# Altium schematic sheet I2C Multiplexer.SchDoc: I2C 8 Channel Multiplexer
size A3; SheetNumber: 29; SheetTotal: 37
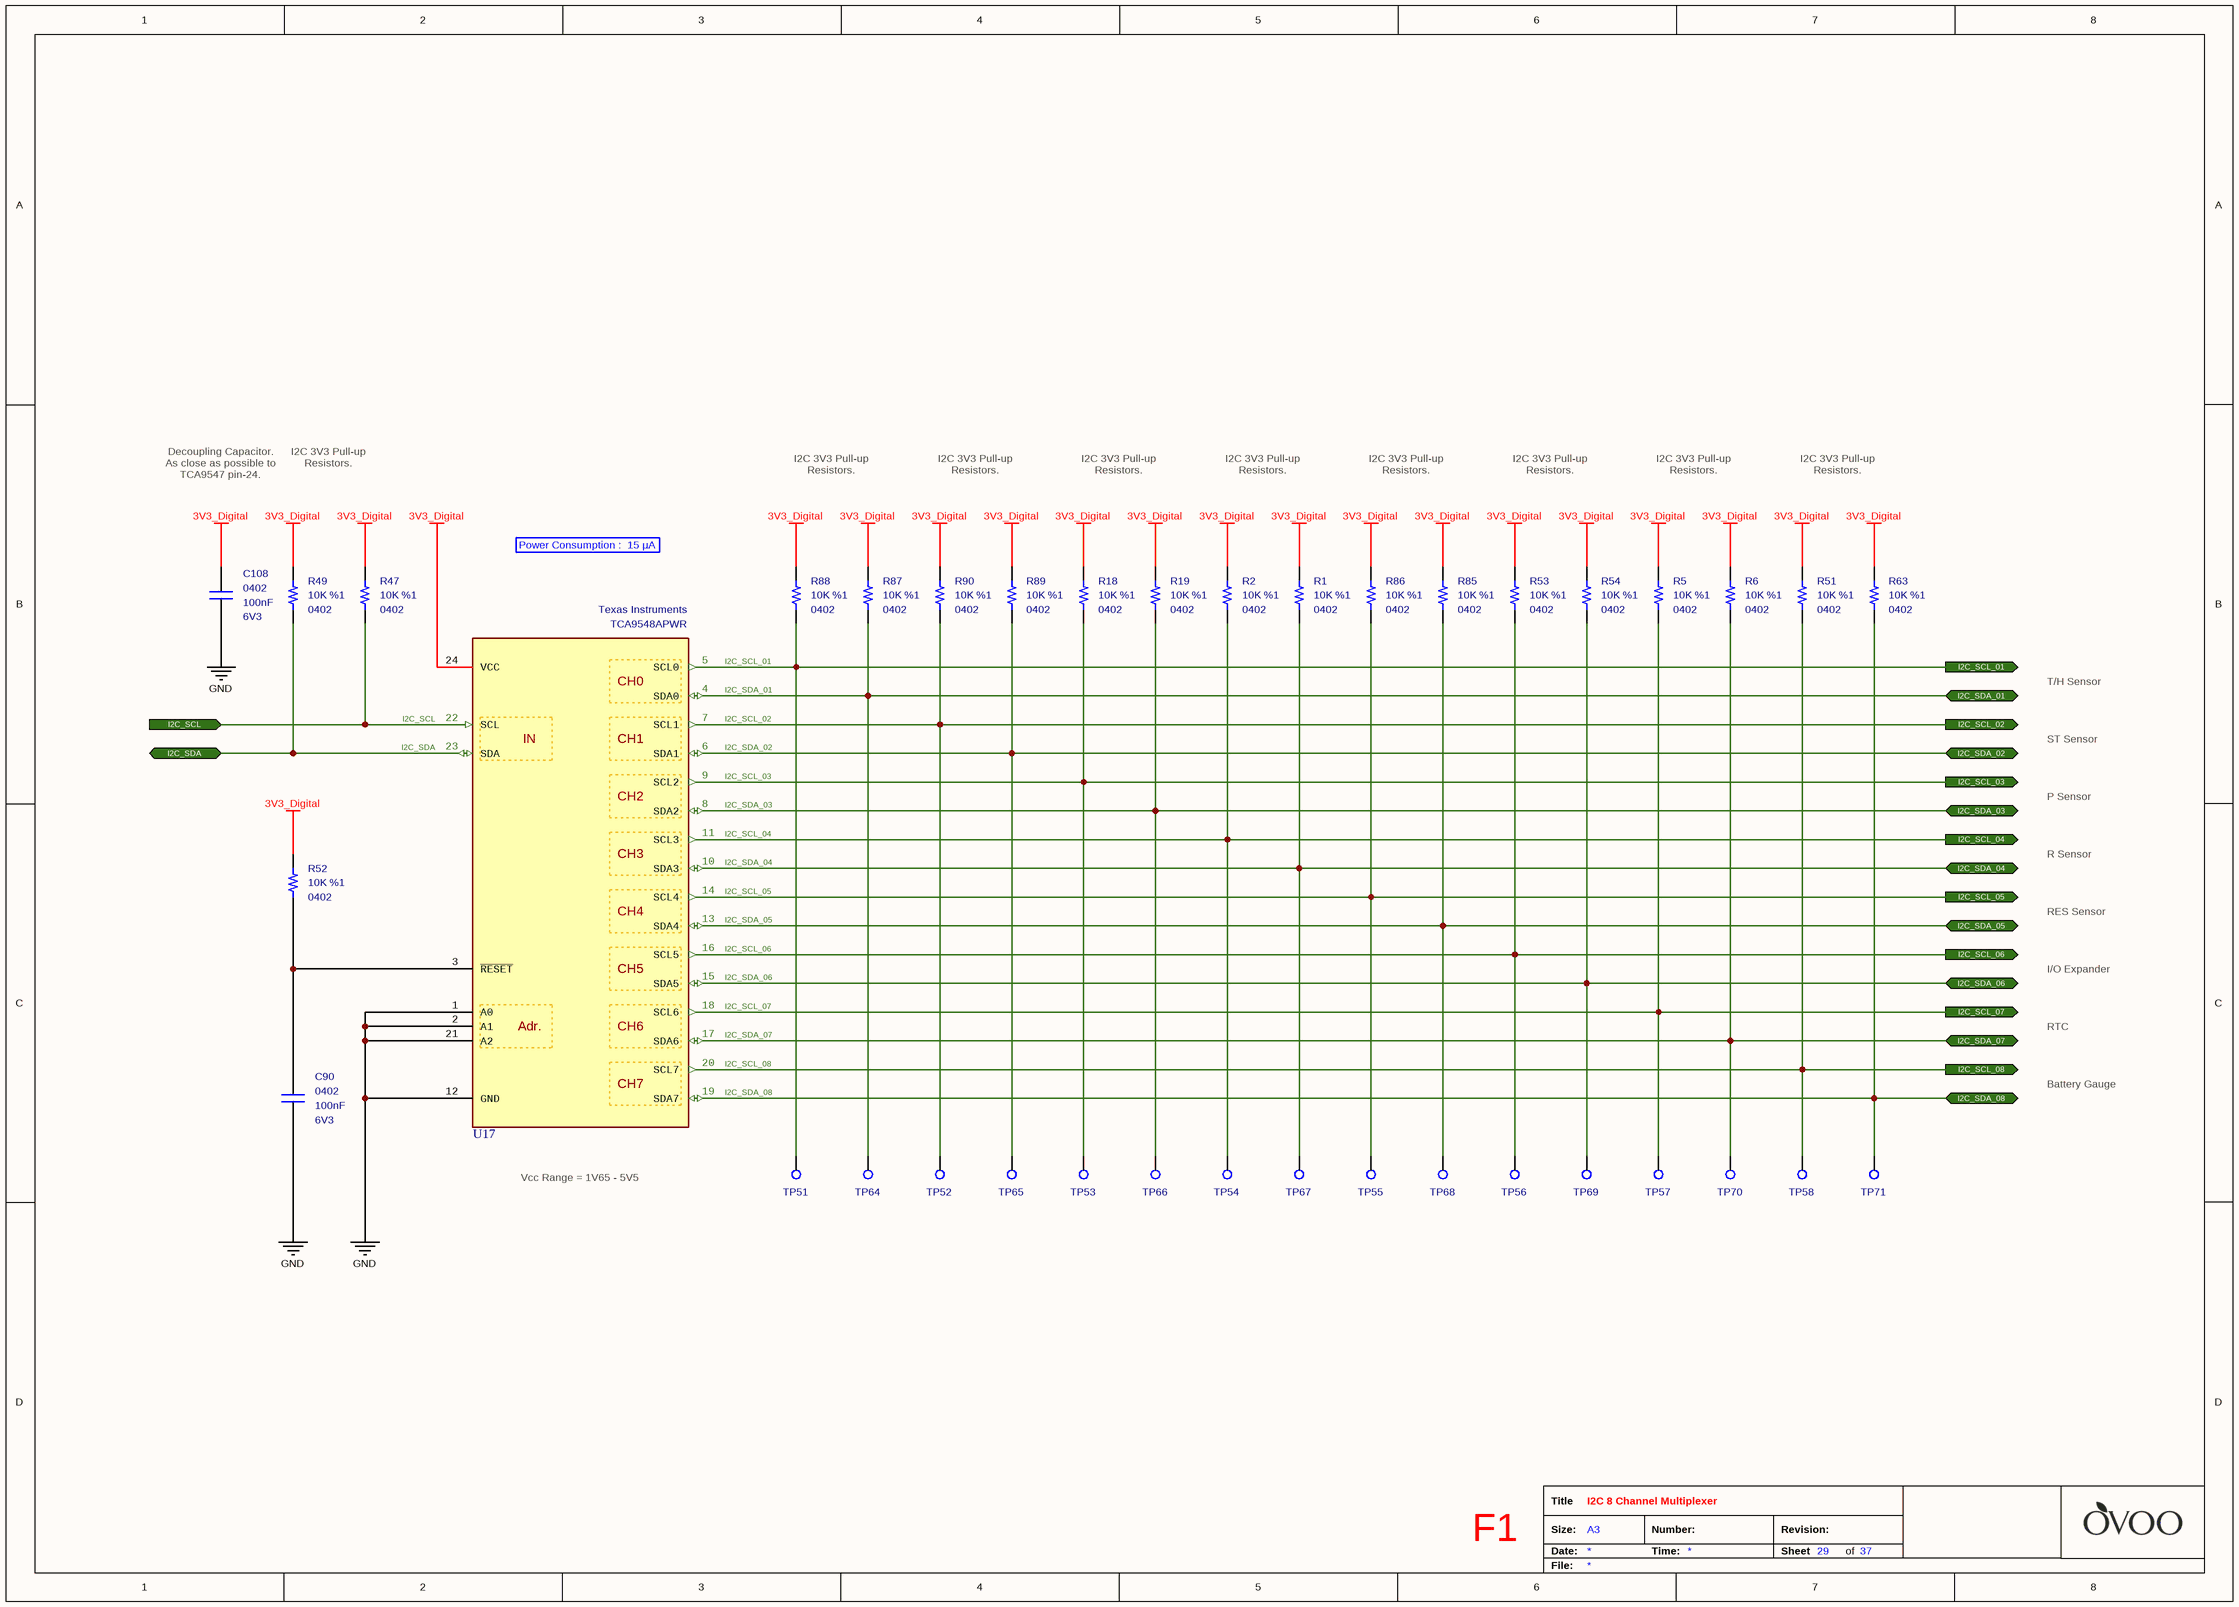
[diagram p0: I2C Multiplexer.SchDoc]

## Parts
C90  value 100nF  Case: 0402  Voltage: 6V3  [CAPACITOR_0402]  (hidden comment: Multilayer Ceramic Capacitor)
C108  value 100nF  Case: 0402  Voltage: 6V3  [CAPACITOR_0402]  (hidden comment: Multilayer Ceramic Capacitor)
R1  value 10K  Tolerance: %1  Case: 0402  [RESISTOR_0402]  (hidden comment: Thick Film Resistor)
R2  value 10K  Tolerance: %1  Case: 0402  [RESISTOR_0402]  (hidden comment: Thick Film Resistor)
R5  value 10K  Tolerance: %1  Case: 0402  [RESISTOR_0402]  (hidden comment: Thick Film Resistor)
R6  value 10K  Tolerance: %1  Case: 0402  [RESISTOR_0402]  (hidden comment: Thick Film Resistor)
R18  value 10K  Tolerance: %1  Case: 0402  [RESISTOR_0402]  (hidden comment: Thick Film Resistor)
R19  value 10K  Tolerance: %1  Case: 0402  [RESISTOR_0402]  (hidden comment: Thick Film Resistor)
R47  value 10K  Tolerance: %1  Case: 0402  [RESISTOR_0402]  (hidden comment: Thick Film Resistor)
R49  value 10K  Tolerance: %1  Case: 0402  [RESISTOR_0402]  (hidden comment: Thick Film Resistor)
R51  value 10K  Tolerance: %1  Case: 0402  [RESISTOR_0402]  (hidden comment: Thick Film Resistor)
R52  value 10K  Tolerance: %1  Case: 0402  [RESISTOR_0402]  (hidden comment: Thick Film Resistor)
R53  value 10K  Tolerance: %1  Case: 0402  [RESISTOR_0402]  (hidden comment: Thick Film Resistor)
R54  value 10K  Tolerance: %1  Case: 0402  [RESISTOR_0402]  (hidden comment: Thick Film Resistor)
R63  value 10K  Tolerance: %1  Case: 0402  [RESISTOR_0402]  (hidden comment: Thick Film Resistor)
R85  value 10K  Tolerance: %1  Case: 0402  [RESISTOR_0402]  (hidden comment: Thick Film Resistor)
R86  value 10K  Tolerance: %1  Case: 0402  [RESISTOR_0402]  (hidden comment: Thick Film Resistor)
R87  value 10K  Tolerance: %1  Case: 0402  [RESISTOR_0402]  (hidden comment: Thick Film Resistor)
R88  value 10K  Tolerance: %1  Case: 0402  [RESISTOR_0402]  (hidden comment: Thick Film Resistor)
R89  value 10K  Tolerance: %1  Case: 0402  [RESISTOR_0402]  (hidden comment: Thick Film Resistor)
R90  value 10K  Tolerance: %1  Case: 0402  [RESISTOR_0402]  (hidden comment: Thick Film Resistor)
TP51  PCB - Test Point  [Test_Pad - Hole]  (value not drawn)  (no BOM)
TP52  PCB - Test Point  [Test_Pad - Hole]  (value not drawn)  (no BOM)
TP53  PCB - Test Point  [Test_Pad - Hole]  (value not drawn)  (no BOM)
TP54  PCB - Test Point  [Test_Pad - Hole]  (value not drawn)  (no BOM)
TP55  PCB - Test Point  [Test_Pad - Hole]  (value not drawn)  (no BOM)
TP56  PCB - Test Point  [Test_Pad - Hole]  (value not drawn)  (no BOM)
TP57  PCB - Test Point  [Test_Pad - Hole]  (value not drawn)  (no BOM)
TP58  PCB - Test Point  [Test_Pad - Hole]  (value not drawn)  (no BOM)
TP64  PCB - Test Point  [Test_Pad - Hole]  (value not drawn)  (no BOM)
TP65  PCB - Test Point  [Test_Pad - Hole]  (value not drawn)  (no BOM)
TP66  PCB - Test Point  [Test_Pad - Hole]  (value not drawn)  (no BOM)
TP67  PCB - Test Point  [Test_Pad - Hole]  (value not drawn)  (no BOM)
TP68  PCB - Test Point  [Test_Pad - Hole]  (value not drawn)  (no BOM)
TP69  PCB - Test Point  [Test_Pad - Hole]  (value not drawn)  (no BOM)
TP70  PCB - Test Point  [Test_Pad - Hole]  (value not drawn)  (no BOM)
TP71  PCB - Test Point  [Test_Pad - Hole]  (value not drawn)  (no BOM)
U17  Manufacturer_Part_Number: TCA9548APWR  Manufacturer_Name: Texas Instruments  [TSSOP-24]  (hidden comment: I2C Switch IC)

## Ports
I2C_SCL (in), I2C_SCL_01 (out), I2C_SCL_02 (out), I2C_SCL_03 (out), I2C_SCL_04 (out), I2C_SCL_05 (out), I2C_SCL_06 (out), I2C_SCL_07 (out), I2C_SCL_08 (out), I2C_SDA (bidir), I2C_SDA_01 (bidir), I2C_SDA_02 (bidir), I2C_SDA_03 (bidir), I2C_SDA_04 (bidir), I2C_SDA_05 (bidir), I2C_SDA_06 (bidir), I2C_SDA_07 (bidir), I2C_SDA_08 (bidir)

## Nets
3V3_Digital: C108.2 R1.2 R2.2 R5.2 R6.2 R18.2 R19.2 R47.2 R49.2 R51.2 R52.2 R53.2 R54.2 R63.2 R85.2 R86.2 R87.2 R88.2 R89.2 R90.2 U17.24(VCC)
GND: C90.1 C108.1 U17.1(A0) U17.2(A1) U17.12(GND) U17.21(A2)
I2C_SCL: R47.1 U17.22(SCL) ; port I2C_SCL
I2C_SCL_01: R88.1 TP51.1 U17.5(SCL0) ; port I2C_SCL_01
I2C_SCL_02: R90.1 TP52.1 U17.7(SCL1) ; port I2C_SCL_02
I2C_SCL_03: R18.1 TP53.1 U17.9(SCL2) ; port I2C_SCL_03
I2C_SCL_04: R2.1 TP54.1 U17.11(SCL3) ; port I2C_SCL_04
I2C_SCL_05: R86.1 TP55.1 U17.14(SCL4) ; port I2C_SCL_05
I2C_SCL_06: R53.1 TP56.1 U17.16(SCL5) ; port I2C_SCL_06
I2C_SCL_07: R5.1 TP57.1 U17.18(SCL6) ; port I2C_SCL_07
I2C_SCL_08: R51.1 TP58.1 U17.20(SCL7) ; port I2C_SCL_08
I2C_SDA: R49.1 U17.23(SDA) ; port I2C_SDA
I2C_SDA_01: R87.1 TP64.1 U17.4(SDA0) ; port I2C_SDA_01
I2C_SDA_02: R89.1 TP65.1 U17.6(SDA1) ; port I2C_SDA_02
I2C_SDA_03: R19.1 TP66.1 U17.8(SDA2) ; port I2C_SDA_03
I2C_SDA_04: R1.1 TP67.1 U17.10(SDA3) ; port I2C_SDA_04
I2C_SDA_05: R85.1 TP68.1 U17.13(SDA4) ; port I2C_SDA_05
I2C_SDA_06: R54.1 TP69.1 U17.15(SDA5) ; port I2C_SDA_06
I2C_SDA_07: R6.1 TP70.1 U17.17(SDA6) ; port I2C_SDA_07
I2C_SDA_08: R63.1 TP71.1 U17.19(SDA7) ; port I2C_SDA_08
NetC90_2: C90.2 R52.1 U17.3(~{RESET})

## Notes on the sheet
- Decoupling Capacitor. As close as possible to TCA9547 pin-24.
- I2C 3V3 Pull-up Resistors.
- Power Consumption :  15 μA
- T/H Sensor
- ST Sensor
- P Sensor
- R Sensor
- RES Sensor
- I/O Expander
- RTC
- Battery Gauge
- Vcc Range = 1V65 - 5V5
- F1
- Title
- Size:
- Date:
- A3
- Number:
- Time:
- Revision:
- Sheet
- of
- File:
- (in symbol IC - TCA9548APWR) CH0; IN; CH1; CH2; CH3; CH4; CH5; Adr.; CH6; CH7

## Library data of the parts
C90 C108 = Capacitor - 100nF [0402-6V3]: Capacitor - 100nF [0402-6V3] (Ceramic); Manufacturer_Name: AVX; Manufacturer_Part_Number: 04026D104KAT4A; Dielectric: X5R; Tolerance: %10; Height: 0.25mm; Mouser_Part_Number: 581-04026D104KAT4A; ComponentLink1Description: Mouser; ComponentLink1URL: https://www.mouser.com.tr/ProductDetail/AVX/04026D104KAT4A?qs=sGAEpiMZZMs0AnBnWHyRQPg4iYkCw7IMED%2F4kpqgf7w%3D; ComponentLink2Description: DataSheet; ComponentLink2URL: https://www.mouser.com.tr/datasheet/2/40/cx5r-776519.pdf; ROHS: Yes; Maximum Operating Temperature: +85; Minimum Operating Temperature: -55; Supplier 1: Avnet; Supplier Part Number 1: 04026D104KAT4A
R1 R2 R5 R6 R18 R19 R47 R49 R51-R54 R63 R85-R90 = Resistor - 10K: Thick Film Resistors - SMD 1/16 W 10 Kohms 1%; Manufacturer_Name: Vishay; Manufacturer_Part_Number: CRCW040210K0FKED; Height: 0.4mm; Mouser_Part_Number: 71-CRCW0402-10K-E3; ComponentLink1Description: DataSheet; ComponentLink1URL: https://www.mouser.com.tr/datasheet/2/427/dcrcwe3-1762152.pdf; ComponentLink2Description: Mouser; ComponentLink2URL: https://www.mouser.com.tr/ProductDetail/Vishay-Dale/CRCW040210K0FKED?qs=sGAEpiMZZMu61qfTUdNhG2DpbjADlD3GcalbOv9utCY%3D; Supplier 1: Mouser; Supplier 2: Digi-Key; Supplier Part Number 1: 71-CRCW040210K0FKEDH; Supplier Part Number 2: 541-10.0KYCT-ND
TP51-TP58 TP64-TP71 = PCB - Test Point: Test Point
U17 = IC - TCA9548APWR: Switch ICs - Various 8-Channel I2C Switch; Mouser Part Number: 595-TCA9548APWR; ComponentLink1Description: DataSheet; ComponentLink1URL: http://www.ti.com/general/docs/suppproductinfo.tsp?distId=26&gotoUrl=http%3A%2F%2Fwww.ti.com%2Flit%2Fgpn%2Ftca9548a; ComponentLink2Description: Mouser; ComponentLink2URL: https://www.mouser.com.tr/ProductDetail/Texas-Instruments/TCA9548APWR?qs=iFaFN7AS2WF%252BqSiJMbdYwQ%3D%3D; Minimum Operating Temperature: -40; Maximum Operating Temperature: +85; Supplier 1: Mouser; Supplier 2: Arrow; Supplier 3: Farnell; Supplier 4: Newark; Supplier 5: Digi-Key; Supplier Part Number 1: 595-TCA9548APWR; Supplier Part Number 2: TCA9548APWR; Supplier Part Number 3: 3124884; Supplier Part Number 4: 33AH5006; Supplier Part Number 5: 296-34905-1-ND; Case: TSSOP-24